# EAGLE design FilterSchematicsAttempt2 (EAGLE 8.2.2)
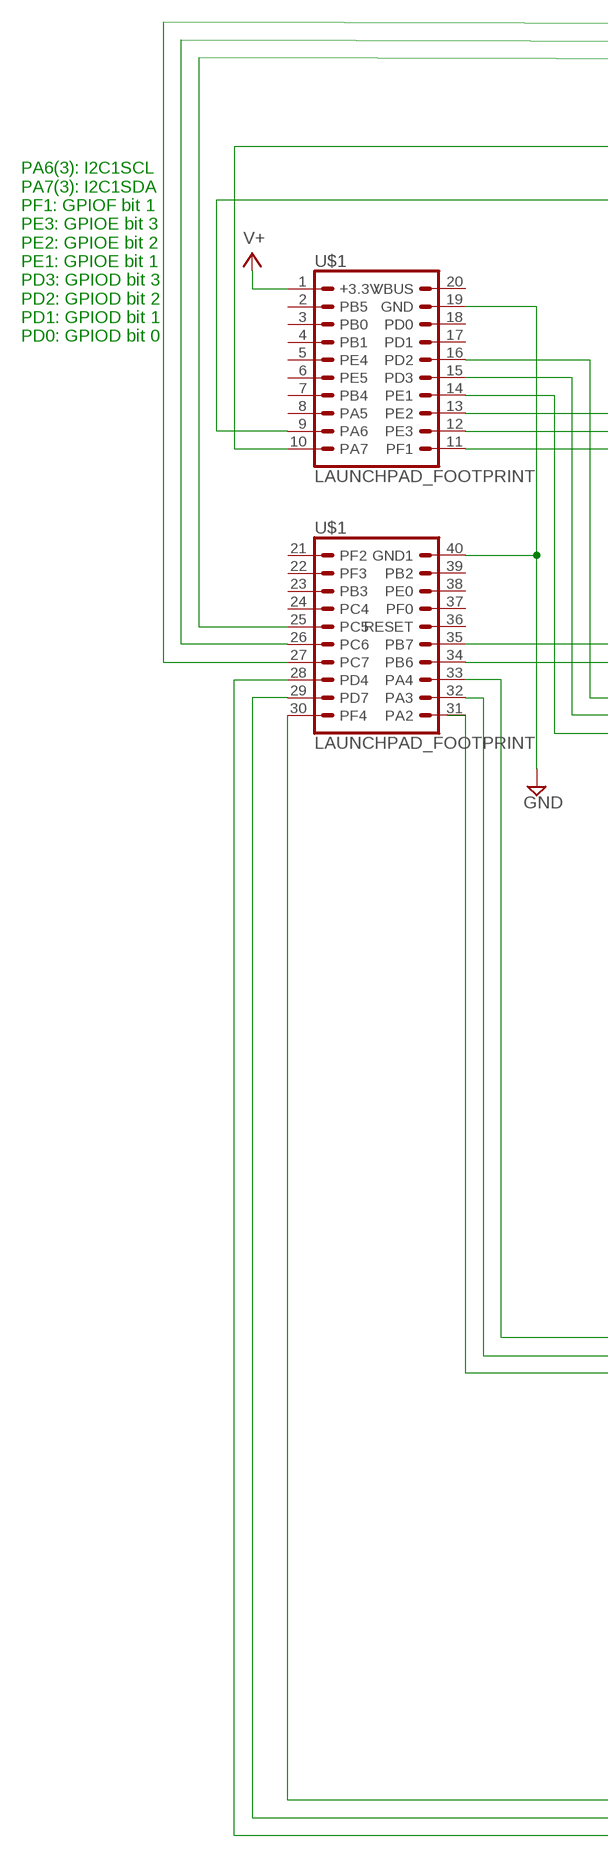
[diagram p0: schematic, sheet 1, part 1 of 3]
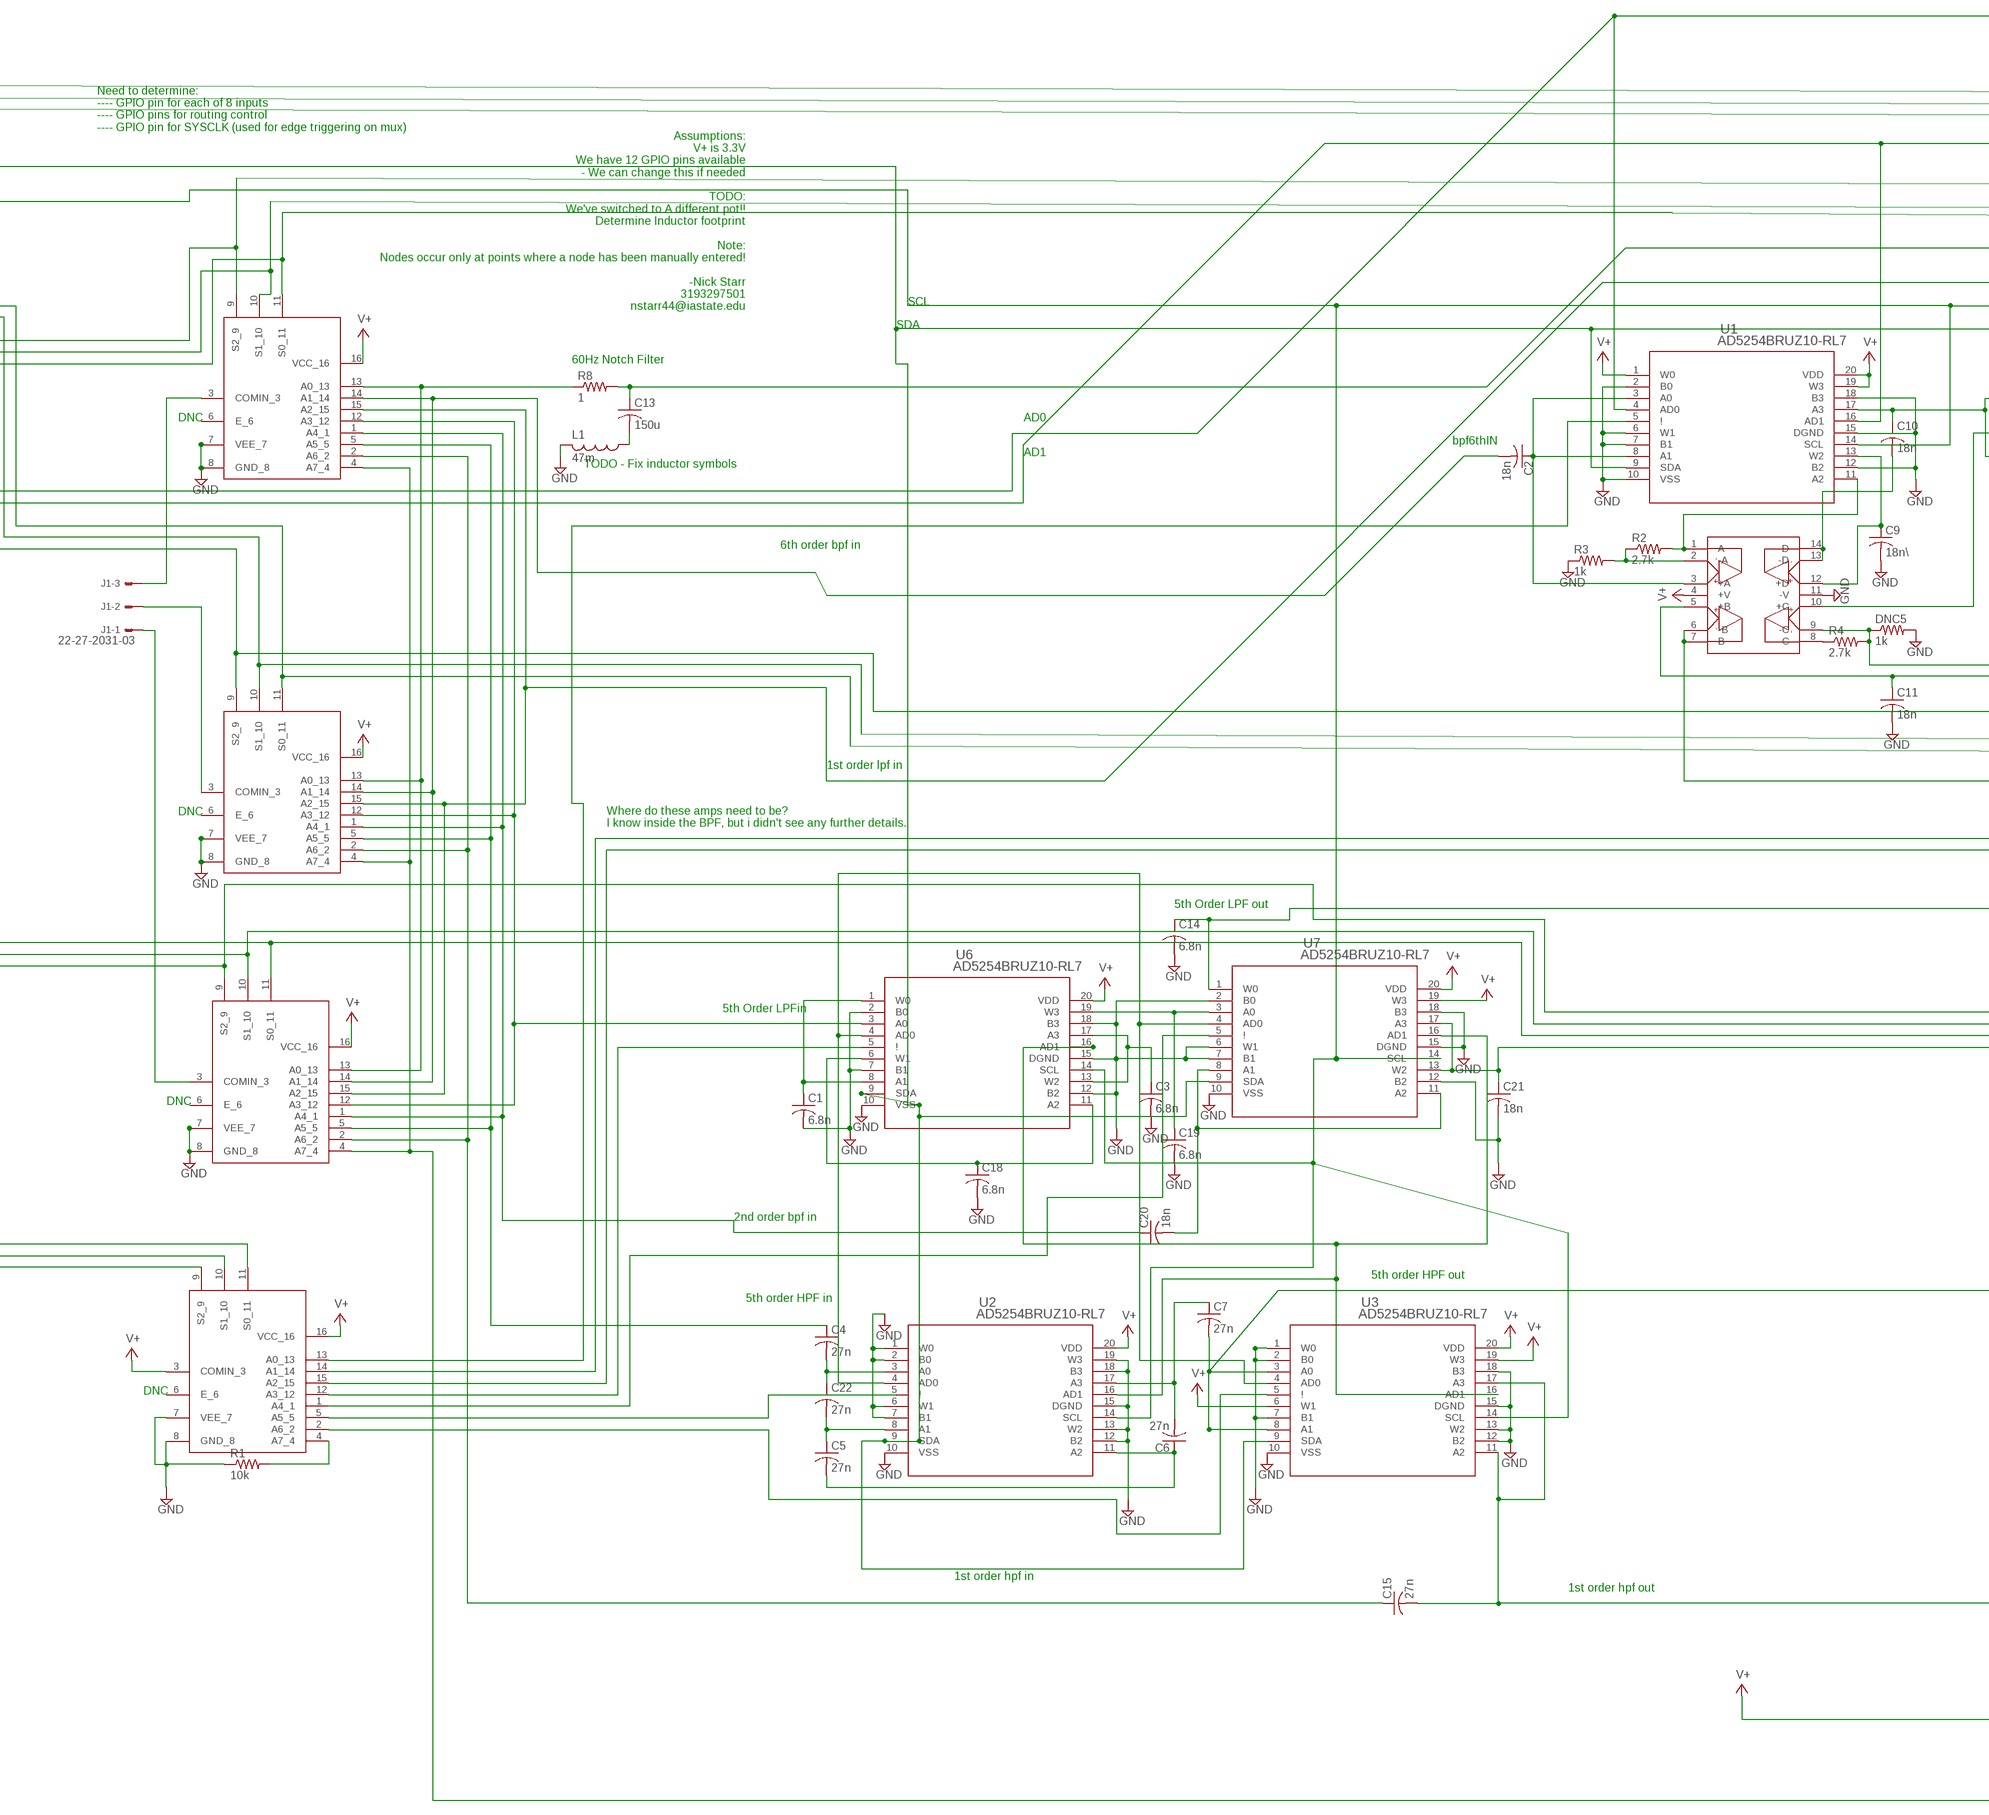
[diagram p1: schematic, sheet 1, part 2 of 3]
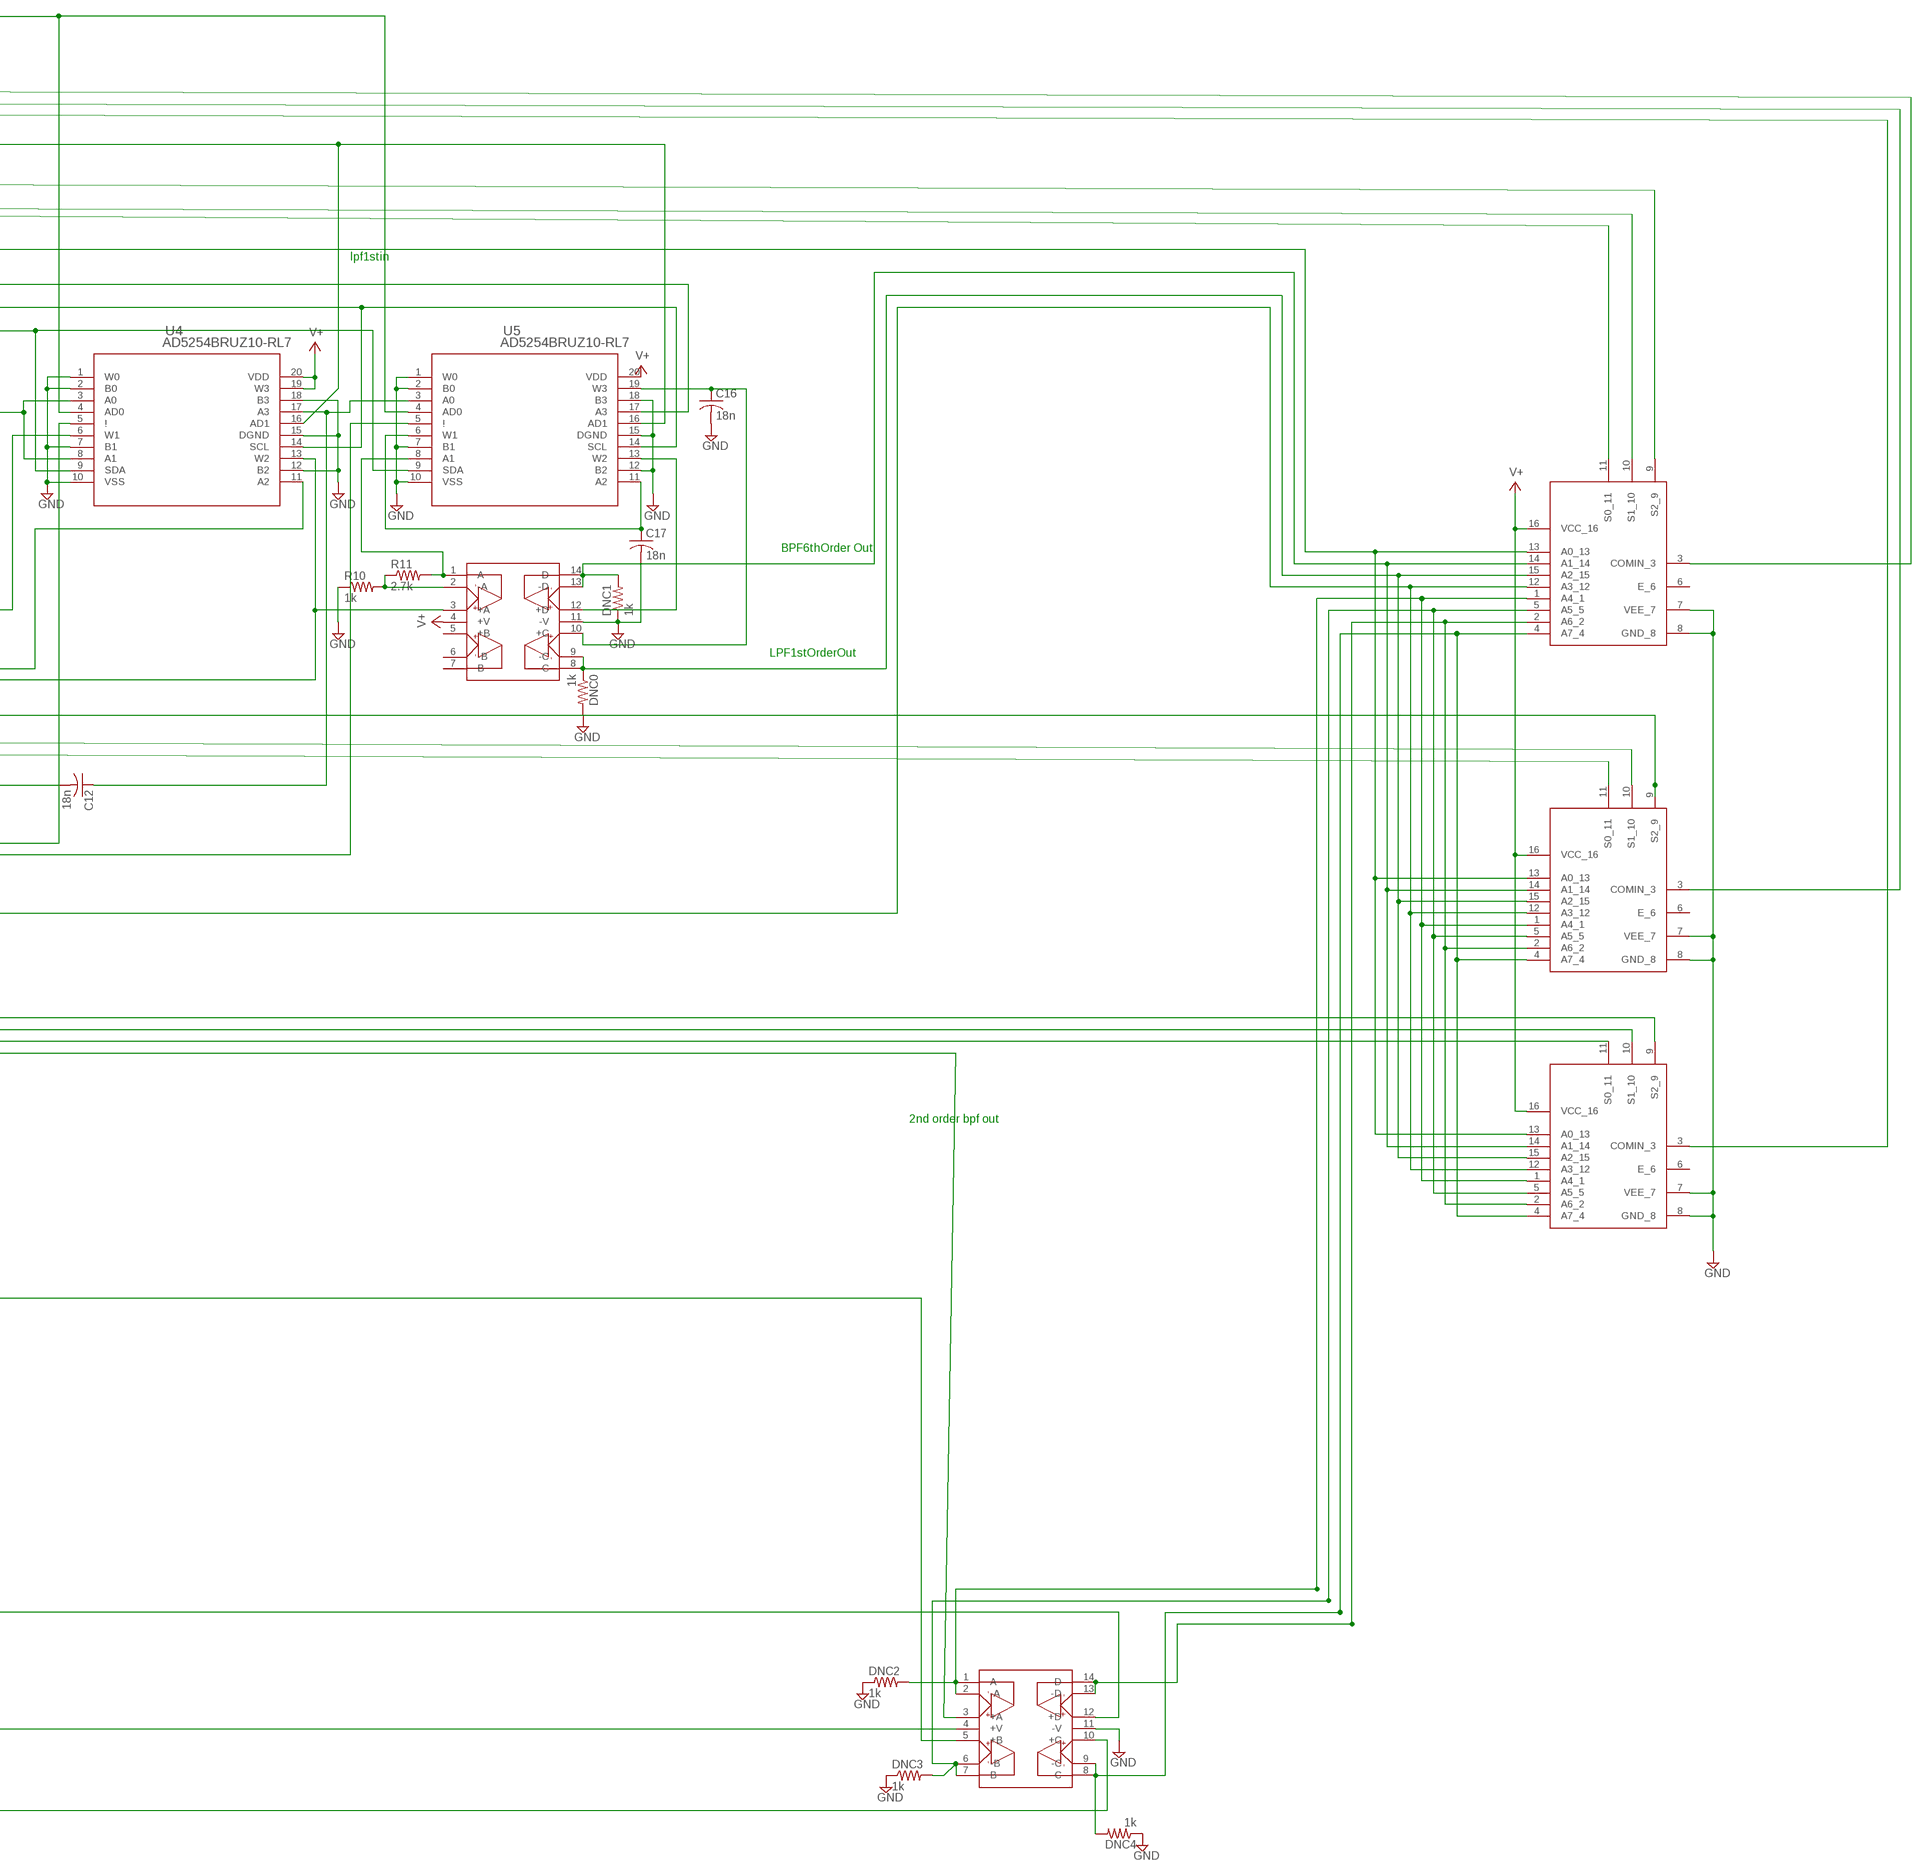
[diagram p2: schematic, sheet 1, part 3 of 3]

## Parts
C1  6.8n  C-USC0805  [C0805]
C2  18n  C-USC0805  [C0805]
C3  6.8n  C-USC0805  [C0805]
C4  27n  C-USC0805  [C0805]
C5  27n  C-USC0805  [C0805]
C6  27n  C-USC0805  [C0805]
C7  27n  C-USC0805  [C0805]
C9  18n\  C-USC0805  [C0805]
C10  18n  C-USC0805  [C0805]
C11  18n  C-USC0805  [C0805]
C12  18n  C-USC0805  [C0805]
C13  150u  C-USC0805  [C0805]
C14  6.8n  C-USC0805  [C0805]
C15  27n  C-USC0805  [C0805]
C16  18n  C-USC0805  [C0805]
C17  18n  C-USC0805  [C0805]
C18  6.8n  C-USC0805  [C0805]
C19  6.8n  C-USC0805  [C0805]
C20  18n  C-USC0805  [C0805]
C21  18n  C-USC0805  [C0805]
C22  27n  C-USC0805  [C0805]
DNC0  1k  R-US_R0805  [R0805]
DNC1  1k  R-US_R0805  [R0805]
DNC2  1k  R-US_R0805  [R0805]
DNC3  1k  R-US_R0805  [R0805]
DNC4  1k  R-US_R0805  [R0805]
DNC5  1k  R-US_R0805  [R0805]
J1  22-27-2031-03  [6410-03]
L1  47m  L-US0204/5  [0204/5]
R1  10k  R-US_R0805  [R0805]
R2  2.7k  R-US_R0805  [R0805]
R3  1k  R-US_R0805  [R0805]
R4  2.7k  R-US_R0805  [R0805]
R8  1  R-US_R0805  [R0805]
R10  1k  R-US_R0805  [R0805]
R11  2.7k  R-US_R0805  [R0805]
U1  AD5254BRUZ10-RL7  [RU_20]
U2  AD5254BRUZ10-RL7  [RU_20]
U3  AD5254BRUZ10-RL7  [RU_20]
U4  AD5254BRUZ10-RL7  [RU_20]
U5  AD5254BRUZ10-RL7  [RU_20]
U6  AD5254BRUZ10-RL7  [RU_20]
U7  AD5254BRUZ10-RL7  [RU_20]
U$1  LAUNCHPAD_FOOTPRINT  [SSW-110-02-S-D]
U$2  OPA4830  [TSSOP14]
U$3  CD74HC4051-Q1  [TSSOP16]
U$4  CD74HC4051-Q1  [TSSOP16]
U$5  CD74HC4051-Q1  [TSSOP16]
U$6  CD74HC4051-Q1  [TSSOP16]
U$7  OPA4830  [TSSOP14]
U$21  CD74HC4051-Q1  [TSSOP16]
U$22  CD74HC4051-Q1  [TSSOP16]
U$23  CD74HC4051-Q1  [TSSOP16]
U$25  OPA4830  [TSSOP14]

## Nets
GND: C1.2 C3.2 C9.2 C11.2 C14.2 C16.2 C17.2 C18.2 C19.2 C21.2 DNC0.2 DNC1.1 DNC2.1 DNC3.1 DNC4.1 DNC5.2 L1.2 R1.1 R3.1 R10.1 U1.2(B0) U1.6(W1) U1.7(B1) U1.10(VSS) U1.12(B2) U1.15(DGND) U1.18(B3) U2.1(W0) U2.2(B0) U2.6(W1) U2.7(B1) U2.10(VSS) U2.12(B2) U2.13(W2) U2.15(DGND) U2.18(B3) U2.19(W3) U3.1(W0) U3.2(B0) U3.7(B1) U3.10(VSS) U3.12(B2) U3.13(W2) U3.15(DGND) U3.18(B3) U4.1(W0) U4.2(B0) U4.7(B1) U4.10(VSS) U4.12(B2) U4.15(DGND) U4.18(B3) U5.1(W0) U5.2(B0) U5.7(B1) U5.10(VSS) U5.12(B2) U5.15(DGND) U5.18(B3) U6.2(B0) U6.7(B1) U6.10(VSS) U6.12(B2) U6.15(DGND) U6.18(B3) U7.2(B0) U7.6(W1) U7.7(B1) U7.10(VSS) U7.12(B2) U7.15(DGND) U7.18(B3) U$1.19(GND) U$1.40(GND1) U$2.11(-V) U$3.7(VEE_7) U$3.8(GND_8) U$4.7(VEE_7) U$4.8(GND_8) U$5.7(VEE_7) U$5.8(GND_8) U$6.7(VEE_7) U$6.8(GND_8) U$7.11(-V) U$21.7(VEE_7) U$21.8(GND_8) U$22.8(GND_8) U$23.7(VEE_7) U$23.8(GND_8)
N$1: J1.3 U$21.3(COMIN_3)
N$2: J1.2 U$22.3(COMIN_3)
N$3: J1.1 U$23.3(COMIN_3)
N$4: U$1.11(PF1) U$3.11(S0_11) U$21.11(S0_11)
N$5: C5.1 C22.2 U2.8(A1)
N$6: C4.2 C22.1 U2.3(A0)
N$7: C5.2 C6.1 U2.11(A2)
N$8: U$1.12(PE3) U$3.10(S1_10) U$21.10(S1_10)
N$9: U$1.13(PE2) U$3.9(S2_9) U$21.9(S2_9)
N$10: U$1.16(PD2) U$4.11(S0_11) U$22.11(S0_11)
N$11: U$1.15(PD3) U$4.10(S1_10) U$22.10(S1_10)
N$12: C2.1 U1.3(A0) U1.8(A1) U$2.3(+A)
N$13: C10.1 U1.17(A3) U4.3(A0) U4.8(A1)
N$14: C13.2 L1.1
N$15: U5.17(A3) U$21.15(A2_15) U$22.15(A2_15) U$23.15(A2_15)
N$16: C15.1 U$21.2(A6_2) U$22.2(A6_2) U$23.2(A6_2)
N$17: C15.2 U3.11(A2) U3.17(A3) U$25.12(+D)
N$18: U6.3(A0) U$21.12(A3_12) U$22.12(A3_12) U$23.12(A3_12)
N$19: U1.5(!) U$6.13(A0_13)
N$20: C1.1 U6.1(W0) U6.8(A1)
N$21: C3.1 U6.13(W2) U6.17(A3)
N$22: C18.1 U6.6(W1) U6.11(A2)
N$23: U$1.33(PA4) U$5.11(S0_11) U$23.11(S0_11)
N$24: R8.1 U$21.13(A0_13) U$22.13(A0_13) U$23.13(A0_13)
N$25: C2.2 U$21.14(A1_14) U$22.14(A1_14) U$23.14(A1_14)
N$26: U$1.32(PA3) U$5.10(S1_10) U$23.10(S1_10)
N$27: U$5.9(S2_9) U$23.9(S2_9)
N$28: R2.2 U1.11(A2) U$2.1(A)
N$29: C4.1 U$21.5(A5_5) U$22.5(A5_5) U$23.5(A5_5)
N$30: C21.1 U7.13(W2) U7.17(A3) U$25.3(+A)
N$31: U$21.4(A7_4) U$22.4(A7_4) U$23.4(A7_4) U$25.10(+C)
N$32: U1.9(SDA) U2.9(SDA) U3.9(SDA) U4.9(SDA) U5.9(SDA) U6.9(SDA) U7.9(SDA) U$1.10(PA7)
N$33: R1.2 U$6.4(A7_4)
N$34: U4.5(!) U$6.14(A1_14)
N$35: U5.5(!) U$6.15(A2_15)
N$36: U6.5(!) U$6.12(A3_12)
N$37: U7.5(!) U$6.1(A4_1)
N$38: U$6.5(A5_5)
N$41: C19.1 U6.19(W3) U7.3(A0)
N$42: DNC0.1 U$3.15(A2_15) U$4.15(A2_15) U$5.15(A2_15) U$7.8(C) U$7.9(-C)
N$44: U3.5(!) U$6.2(A6_2)
N$45: R2.1 R3.2 U$2.2(-A)
N$46: DNC3.2 U$3.5(A5_5) U$4.5(A5_5) U$5.5(A5_5) U$25.6(-B) U$25.7(B)
N$47: DNC2.2 U$3.1(A4_1) U$4.1(A4_1) U$5.1(A4_1) U$25.1(A) U$25.2(-A)
N$48: U$3.2(A6_2) U$4.2(A6_2) U$5.2(A6_2) U$25.13(-D) U$25.14(D)
N$49: DNC4.2 U$3.4(A7_4) U$4.4(A7_4) U$5.4(A7_4) U$25.8(C) U$25.9(-C)
N$50: C9.1 U1.13(W2) U$2.12(+D)
N$52: U1.16(AD1) U4.16(AD1) U5.16(AD1) U$1.34(PB6)
N$53: U4.6(W1) U$2.10(+C)
N$54: C10.2 U$2.13(-D) U$2.14(D)
N$55: U2.16(AD1) U3.16(AD1) U6.16(AD1) U7.16(AD1)
N$56: U$1.30(PF4) U$6.11(S0_11)
N$57: R4.1 U$2.8(C)
N$58: DNC5.1 R4.2 U4.11(A2) U$2.9(-C)
N$59: C20.1 U$21.1(A4_1) U$22.1(A4_1) U$23.1(A4_1)
N$60: C20.2 U7.8(A1) U7.11(A2)
N$61: U$22.7(VEE_7)
N$62: C6.2 C7.1 U2.17(A3)
N$63: C11.1 U4.13(W2) U$2.5(+B) U$7.3(+A)
N$64: U$1.25(PC5) U$5.3(COMIN_3)
N$65: U$1.26(PC6) U$4.3(COMIN_3)
N$66: U$1.28(PD4) U$6.9(S2_9)
N$67: C7.2 U3.3(A0) U3.8(A1) U$25.5(+B)
N$68: U$1.29(PD7) U$6.10(S1_10)
N$69: U$1.27(PC7) U$3.3(COMIN_3)
N$70: C12.1 U4.17(A3) U5.3(A0)
N$72: C12.2 U$2.6(-B) U$2.7(B)
N$73: R11.2 U5.8(A1) U$7.1(A)
N$74: R10.2 R11.1 U$7.2(-A)
N$75: C17.1 U5.6(W1) U5.11(A2)
N$76: U5.13(W2) U$7.12(+D)
N$77: DNC1.2 U$3.14(A1_14) U$4.14(A1_14) U$5.14(A1_14) U$7.13(-D) U$7.14(D)
N$79: C16.1 U5.19(W3) U$7.10(+C)
N$80: C14.1 U7.1(W0) U$3.12(A3_12) U$4.12(A3_12) U$5.12(A3_12)
N$88: C13.1 R8.2 U$3.13(A0_13) U$4.13(A0_13) U$5.13(A0_13)
N$95: U$1.14(PE1) U$4.9(S2_9) U$22.9(S2_9)
N$97: U2.4(AD0) U3.4(AD0) U6.4(AD0) U7.4(AD0)
N$98: U1.4(AD0) U4.4(AD0) U5.4(AD0) U$1.35(PB7)
N$101: U1.14(SCL) U2.14(SCL) U3.14(SCL) U4.14(SCL) U5.14(SCL) U6.14(SCL) U7.14(SCL) U$1.9(PA6)
V+: U1.1(W0) U1.19(W3) U1.20(VDD) U2.20(VDD) U3.6(W1) U3.19(W3) U3.20(VDD) U4.19(W3) U4.20(VDD) U5.20(VDD) U6.20(VDD) U7.19(W3) U7.20(VDD) U$1.1(+3.3V) U$2.4(+V) U$3.16(VCC_16) U$4.16(VCC_16) U$5.16(VCC_16) U$6.3(COMIN_3) U$6.16(VCC_16) U$7.4(+V) U$22.16(VCC_16) U$23.16(VCC_16) U$25.4(+V)
V-: U$25.11(-V) ; supply symbol labelled GND
Unconnected: U2.5(!) U$1.2(PB5) U$1.3(PB0) U$1.4(PB1) U$1.5(PE4) U$1.6(PE5) U$1.7(PB4) U$1.8(PA5) U$1.17(PD1) U$1.18(PD0) U$1.20(VBUS) U$1.21(PF2) U$1.22(PF3) U$1.23(PB3) U$1.24(PC4) U$1.31(PA2) U$1.36(RESET) U$1.37(PF0) U$1.38(PE0) U$1.39(PB2) U$3.6(E_6) U$4.6(E_6) U$5.6(E_6) U$6.6(E_6) U$7.5(+B) U$7.6(-B) U$7.7(B) U$21.6(E_6) U$21.16(VCC_16) U$22.6(E_6) U$23.6(E_6)

## Notes on the sheet
- Assumptions:
  V+ is 3.3V
  We have 12 GPIO pins available
  - We can change this if needed
  
  TODO:
  We've switched to A different pot!!
  Determine Inductor footprint
  
  Note:
  Nodes occur only at points where a node has been manually entered!
  
  -Nick Starr
  3193297501
  nstarr44@iastate.edu
- Need to determine:
  ---- GPIO pin for each of 8 inputs
  ---- GPIO pins for routing control
  ---- GPIO pin for SYSCLK (used for edge triggering on mux)
- lpf1stin
- PA6(3): I2C1SCL
  PA7(3): I2C1SDA
  PF1: GPIOF bit 1
  PE3: GPIOE bit 3
  PE2: GPIOE bit 2
  PE1: GPIOE bit 1
  PD3: GPIOD bit 3
  PD2: GPIOD bit 2
  PD1: GPIOD bit 1
  PD0: GPIOD bit 0
- SCL
- SDA
- 60Hz Notch Filter
- DNC | AD0
- bpf6thIN
- AD1
- TODO - Fix inductor symbols
- 6th order bpf in | BPF6thOrder Out
- LPF1stOrderOut
- 1st order lpf in
- DNC
- Where do these amps need to be?
  I know inside the BPF, but i didn't see any further details.
- 5th Order LPF out
- 5th Order LPFin
- DNC
- 2nd order bpf out
- 2nd order bpf in
- 5th order HPF out
- 5th order HPF in
- DNC
- 1st order hpf in
- 1st order hpf out

## Library data of the parts
C1-C7 C9-C22 = rcl:C-US: CAPACITOR, American symbol
DNC0 DNC1-DNC5 R1-R4 R8 R10 R11 = rcl:R-US_: RESISTOR, American symbol
J1 = con-molex:22-?-03: CONNECTOR wire to board 2.54 mm (.1 inch) pitch header; OC_FARNELL: unknown; OC_NEWARK: unknown
L1 = rcl:L-US: INDUCTOR, American symbol
U1-U7 = 491Library:AD5254BRUZ10-RL7; MANUFACTURER_PART_NUMBER: AD5254BRUZ10RL7; VENDOR: Analog Devices Inc
U$1 = 491Library:LAUNCHPAD_FOOTPRINT
U$2 U$7 U$25 = 491Library:OPA4830
U$3-U$6 U$21-U$23 = 491Library:CD74HC4051-Q1

## Board
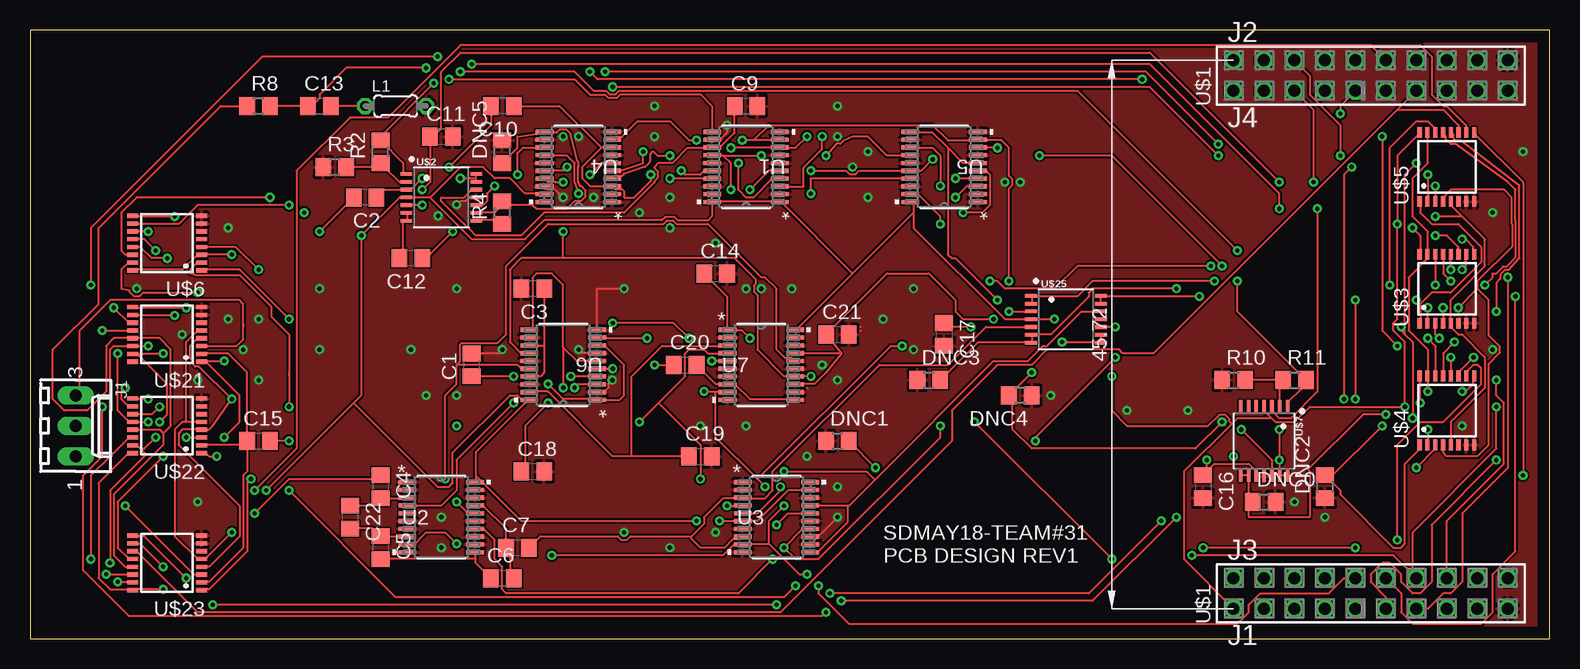
[diagram p3: board, top side]
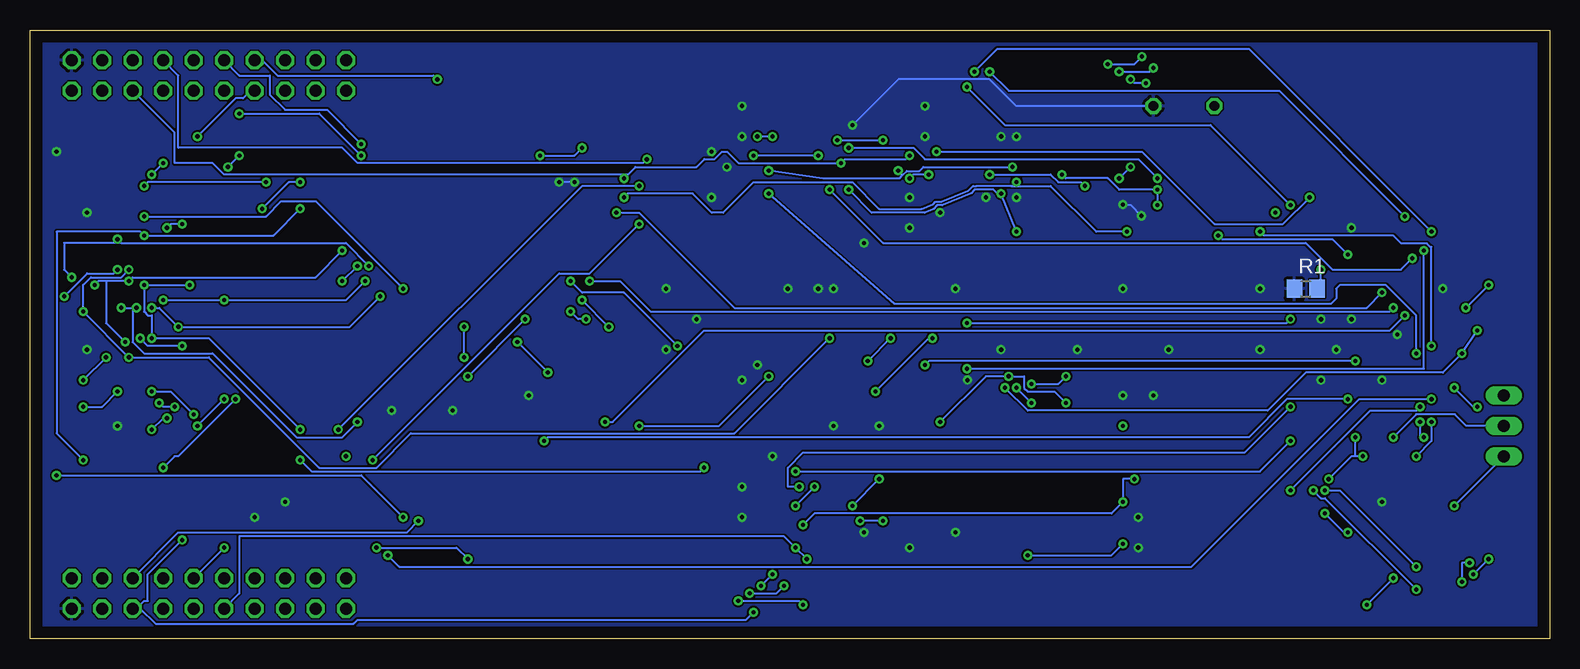
[diagram p4: board, bottom side, seen from below]

Size 126.67 x 50.79 mm. Coordinates in mm from the lower left corner, seen from the top.
Outline: 0,0 126.67,0 126.67,50.79 0,50.79 0,0
Copper layers (1*16): Top 0.035mm / dielectric 1.5mm / Bottom 0.035mm
Design rules "default": minimum track width 6mil, minimum drill 0.35mm, track to track 6mil, track to pad 6mil, pad to pad 6mil, via to via 6mil, smd to smd 6mil, copper to edge 40mil, drill to drill 6mil, minimum pad ring 10mil, minimum via ring 8mil, stop-mask expansion 4mil, vias tented up to drill 0mil, thermal gap 10mil

### Footprints (pad centres in the part's own frame; a part is rotated, then mirrored left to right if it is on the bottom)
C0805 = smd 1.3 x 1.5: 1 -0.95,0; 2 0.95,0
R0805 = smd 1.3 x 1.5: 1 -0.95,0; 2 0.95,0
6410-03 = drill 1.016 long: 1 2.54,0; 2 0,0; 3 -2.54,0
0204/5 = drill 0.813 octagon: 1 -2.54,0; 2 2.54,0
RU_20 = smd 1.473 x 0.356: 1 -2.819,2.925; 2 -2.819,2.275; 3 -2.819,1.625; 4 -2.819,0.975; 5 -2.819,0.325; 6 -2.819,-0.325; 7 -2.819,-0.975; 8 -2.819,-1.625; 9 -2.819,-2.275; 10 -2.819,-2.925; 11 2.819,-2.925; 12 2.819,-2.275; 13 2.819,-1.625; 14 2.819,-0.975; 15 2.819,-0.325; 16 2.819,0.325; 17 2.819,0.975; 18 2.819,1.625; 19 2.819,2.275; 20 2.819,2.925
SSW-110-02-S-D = drill 1 pad 1.5 octagon: 1 -22.86,11.43; 2 -20.32,11.43; 3 -22.86,8.89; 4 -20.32,8.89; 5 -22.86,6.35; 6 -20.32,6.35; 7 -22.86,3.81; 8 -20.32,3.81; 9 -22.86,1.27; 10 -20.32,1.27; 11 -22.86,-1.27; 12 -20.32,-1.27; 13 -22.86,-3.81; 14 -20.32,-3.81; 15 -22.86,-6.35; 16 -20.32,-6.35; 17 -22.86,-8.89; 18 -20.32,-8.89; 19 -22.86,-11.43; 20 -20.32,-11.43; 21 20.32,11.43; 22 22.86,11.43; 23 20.32,8.89; 24 22.86,8.89; 25 20.32,6.35; 26 22.86,6.35; 27 20.32,3.81; 28 22.86,3.81; 29 20.32,1.27; 30 22.86,1.27; 31 20.32,-1.27; 32 22.86,-1.27; 33 20.32,-3.81; 34 22.86,-3.81; 35 20.32,-6.35; 36 22.86,-6.35; 37 20.32,-8.89; 38 22.86,-8.89; 39 20.32,-11.43; 40 22.86,-11.43
TSSOP14 = smd 0.305 x 0.991: 1 -1.95,-2.918; 2 -1.3,-2.918; 3 -0.65,-2.918; 4 0,-2.918; 5 0.65,-2.918; 6 1.3,-2.918; 7 1.95,-2.918; 8 1.95,2.918; 9 1.3,2.918; 10 0.65,2.918; 11 0,2.918; 12 -0.65,2.918; 13 -1.3,2.918; 14 -1.95,2.918
TSSOP16 = smd 0.9 x 0.35: 1 -2.875,2.275; 2 -2.875,1.625; 3 -2.875,0.975; 4 -2.875,0.325; 5 -2.875,-0.325; 6 -2.875,-0.975; 7 -2.875,-1.625; 8 -2.875,-2.275; 9 2.875,-2.275; 10 2.875,-1.625; 11 2.875,-0.975; 12 2.875,-0.325; 13 2.875,0.325; 14 2.875,0.975; 15 2.875,1.625; 16 2.875,2.275

### Placement (x,y rotation side)
C1  36.83,22.86 90 top
C2  27.94,36.83 180 top
C3  41.91,29.21 180 top
C4  29.21,12.7 270 top
C5  29.21,7.62 270 top
C6  39.37,5.08 0 top
C7  40.64,7.62 0 top
C9  59.69,44.45 0 top
C10  39.37,44.45 180 top
C11  34.29,41.91 0 top
C12  31.75,31.75 180 top
C13  24.13,44.45 0 top
C14  57.15,30.48 0 top
C15  19.05,16.51 0 top
C16  97.79,12.7 270 top
C17  76.2,25.4 270 top
C18  41.91,13.97 0 top
C19  55.88,15.24 0 top
C20  54.61,22.86 0 top
C21  67.31,25.4 0 top
C22  26.67,10.16 270 top
DNC0  102.87,11.43 0 top
DNC1  67.31,16.51 0 top
DNC2  107.95,12.7 90 top
DNC3  74.93,21.59 0 top
DNC4  82.55,20.32 180 top
DNC5  39.37,40.64 90 top
J1  3.81,17.78 270 top
L1  30.48,44.45 0 top
R1  20.32,29.21 0 bottom
R2  29.21,40.64 90 top
R3  25.4,39.37 0 top
R4  39.37,35.56 90 top
R8  19.05,44.45 0 top
R10  100.33,21.59 0 top
R11  105.41,21.59 0 top
U1  59.69,39.37 180 top
U2  34.29,10.16 0 top
U3  62.23,10.16 0 top
U4  45.72,39.37 180 top
U5  76.2,39.37 180 top
U6  44.45,22.86 180 top
U7  60.96,22.86 0 top
U$1  111.76,25.4 90 top
U$2  34.29,36.83 270 top
U$3  118.11,29.21 90 top
U$4  118.11,19.05 90 top
U$5  118.11,39.37 90 top
U$6  11.43,33.02 180 top
U$7  102.87,16.51 180 top
U$21  11.43,25.4 180 top
U$22  11.43,17.78 180 top
U$23  11.43,6.35 180 top
U$25  86.36,26.67 270 top

### Tracks (layer width: path | path; a pad name or v marks a point on that pad's centre or on a via)
GND  (via drill 0.35)
  Top 0.152: v58.1,42.86 58.1,42.23 57.47,41.59 57.15,41.59 U1.12 | C17.2 76.28,24.37 | 69.22,25.72 69.24,25.72 | 69.22,26.04 69.24,26.04 | 64.77,20.95 64.82,20.89 | U7.10 58.1,20 58.13,19.92 | v39.37,24.13 39.05,23.81 C1.2 | U6.10 47.27,29.21 v49.53,29.21 | v48.54,21.59 48.23,21.29 48.23,20.96 47.86,20.59 U6.2 | U6.7 46.02,23.84 v45.72,24.13 | U3.12 65.05,7.9 v67.31,10.16 | U$2.11 36.63,36.83 36.32,36.52 35.86,36.52 v35.56,36.22 | U4.18 43.14,37.5 43.73,37.5 44.4,36.83 v44.45,36.83
  Bottom 0.152: v58.1,42.86 54.29,46.67 46.67,46.67 44.45,44.45 L1.2 | v35.56,36.22 34.95,36.22 v34.02,35.29 | v81.28,38.1 v82.55,38.1
  other vias: 12.7,25.4 17.78,24.13 19.05,21.59 13.97,21.59 24.13,29.21 24.13,24.13 33.02,20.32 35.56,20.32 31.75,24.13 35.56,29.21 55.88,17.78 59.69,17.78 64.77,15.24 67.31,12.7 73.66,24.13 85.09,20.32 91.44,19.05 96.52,19.05 105.41,11.43 107.95,10.16 66.04,22.86 67.31,21.59 71.12,26.67 73.66,29.21 67.31,44.45 67.31,41.91 69.85,40.64 13.97,11.43 46.99,36.83 53.34,34.29 57.15,33.02 50.8,35.56 60.96,29.21 63.5,29.21 57.15,8.89 49.53,8.89 53.34,7.62 68.58,39.37 69.85,36.83 16.51,26.67 19.05,26.67 8.89,29.21 16.51,34.29 124.46,40.64 121.92,35.56 121.92,24.13 34.29,10.16 34.29,7.62 59.69,29.21 44.45,41.91 45.72,41.91 53.34,36.83 52.07,44.45 52.07,41.91 119.38,17.78
  pour Bottom: 0,50.8 0,0 127,0 127,50.8
  pour Top: 0,50.8 127,50.8 127,0 0,0
N$1
  Top 0.152: 17.78,26.29 17.78,26.04 | 17.78,26.29 17.78,27.94 17.46,28.26 6.67,28.26 4.13,25.72 4.13,20.64 J1.3 | U$21.3 14.61,24.45 17.24,24.45 17.35,24.56 | 17.53,24.74 17.35,24.56 | 17.35,24.56 17.53,24.74 | 17.53,24.74 17.78,24.99 17.78,26.29
N$2  (via drill 0.35)
  Top 0.152: v13.02,16.83 14.29,16.83 U$22.3
  Bottom 0.152: v13.02,16.83 11.11,18.73 7.89,18.73 6.93,17.78 J1.2 4.13,17.78
N$3  (via drill 0.35)
  Top 0.152: v7.94,11.11 13.65,5.4 14.29,5.4 U$23.3
  Bottom 0.152: J1.1 v7.94,11.11
N$4  (via drill 0.35)
  Top 0.152: v6.99,27.62 8.26,26.35 U$21.11 | v5.08,29.53 5.08,34.29 19.37,48.58 v33.97,48.58 | v36.83,47.94 93.34,47.94 104.14,37.15 v104.14,35.88 | v117.16,33.66 118.11,33.66 119.06,32.7 119.06,32.38 U$3.11 | U$1.11 113.03,3.49 111.76,4.76 111.76,5.4 112.71,6.35 113.35,6.35 114.3,5.4 114.3,4.76 115.25,3.81 115.89,3.81 116.84,4.76 116.84,9.53 v122.24,14.92
  Bottom 0.152: v5.08,29.53 v6.99,27.62 | v33.97,48.58 34.61,47.94 v36.83,47.94 | v104.14,35.88 106.36,33.66 v117.16,33.66 117.47,33.97 124.46,33.97 124.46,17.14 v122.24,14.92
N$5
  Top 0.152: C5.1 31.43,8.57 U2.8 | C5.1 28.57,9.21 C22.2 | C5.1
N$6
  Top 0.152: C4.2 31.43,11.75 U2.3 | C4.2 28.57,11.11 C22.1 | C4.2
N$7
  Top 0.152: 37.15,6.67 37.15,6.35 C6.1 | 37.15,6.67 37.15,7.3 U2.11 | 37.15,6.67 C5.2
N$8  (via drill 0.35)
  Top 0.152: v12.06,26.99 8.57,26.99 U$21.10 | v90.17,6.67 v78.74,18.1 | v110.49,7.62 v97.79,7.62 | v119.38,30.8 119.7,31.11 119.7,32.07 U$3.10 | v123.83,28.57 123.83,7.3 121.92,5.4 121.92,2.22 120.97,1.27 115.25,1.27 114.3,2.22 114.3,3.81 U$1.12
  Bottom 0.152: v12.06,26.99 13.34,25.72 70.48,25.72 78.11,18.1 v78.74,18.1 | v90.17,6.67 91.12,7.62 v97.79,7.62 | U$1.12 v110.49,7.62 | v119.38,30.8 119.7,30.48 121.92,30.48 v123.83,28.57
N$9  (via drill 0.35)
  Top 0.152: v13.02,27.62 8.57,27.62 U$21.9 | v80.01,29.84 80.64,29.84 81.28,29.21 85.41,29.21 87.31,31.11 v98.42,31.11 | v119.38,33.34 119.7,33.34 120.33,32.7 120.33,32.38 U$3.9 | U$1.13 116.52,2.54 117.79,3.81 118.43,3.81 119.38,4.76 119.38,10.48 123.19,14.29 v123.19,30.16
  Bottom 0.152: v13.02,27.62 13.34,27.3 74.93,27.3 77.47,29.84 v80.01,29.84 | v98.42,31.11 100.33,33.02 119.06,33.02 | v119.38,33.34 119.06,33.02 | v123.19,30.16 123.83,30.8 123.83,33.02 119.06,33.02
N$10  (via drill 0.35)
  Top 0.152: v10.79,19.37 10.16,18.73 8.57,18.73 U$22.11 | v21.59,12.38 30.48,3.49 62.87,3.49 v63.82,4.45 | v66.67,3.81 88.27,3.81 v94.3,9.84 | v120.33,23.5 119.06,22.23 U$4.11 | v122.24,21.59 122.24,20.32 122.87,19.68 122.87,14.61 118.11,9.84 U$1.16
  Bottom 0.152: v10.79,19.37 11.11,19.05 14.92,19.05 v21.59,12.38 | v63.82,4.45 64.45,3.81 v66.67,3.81 | v94.3,9.84 95.25,8.89 114.3,8.89 U$1.16 | v122.24,21.59 v120.33,23.5
N$11  (via drill 0.35)
  Top 0.152: v7.94,20.95 7.62,20.64 7.62,20 8.26,19.37 U$22.10 | v6.03,19.37 6.03,15.24 4.45,13.65 4.45,5.71 8.26,1.91 66.04,1.91 v66.36,2.22 | v113.98,8.26 113.98,16.19 115.89,18.1 117.79,18.1 120.97,21.27 120.97,22.54 120.65,22.86 120.33,22.86 119.7,22.23 U$4.10
  Bottom 0.152: v7.94,20.95 6.35,19.37 v6.03,19.37 | v66.36,2.22 66.99,1.59 99.38,1.59 99.69,1.27 116.2,1.27 117.47,2.54 117.79,2.54 | v113.98,8.26 116.84,5.4 116.84,3.17 117.16,3.17 117.79,2.54 | 117.79,2.54 U$1.15
N$12  (via drill 0.35)
  Top 0.152: C2.1 29.53,37.47 31.11,37.47 U$2.3 31.43,37.47 31.75,37.47 v32.7,38.42 | 63.18,37.78 62.55,37.78 U1.3 64.48,37.74 64.48,39.3 66.04,40.86 v66.04,41.91 | v58.42,40.96 62.23,40.96 U1.8 62.55,40.96 63.82,40.96 v64.77,41.91
  Bottom 0.152: v32.7,38.42 34.29,40.01 52.07,40.01 53.02,40.96 v58.42,40.96 | v64.77,41.91 v66.04,41.91
N$13  (via drill 0.35)
  Top 0.152: 47.62,40.96 46.04,39.37 46.04,38.42 46.67,37.78 48.26,37.78 U4.3 | 47.62,40.96 48.26,40.96 U4.8 | v53.34,38.42 56.83,38.42 U1.17 | 48.58,37.78 U4.3 | C10.1 44.13,44.45 47.62,40.96 | U4.3 48.8,37.5 49.37,37.5 49.51,37.37 49.51,36.85 49.53,36.83 50.37,36.83 51.75,38.21 v51.75,38.73
  Bottom 0.152: v53.34,38.42 53.02,38.73 v51.75,38.73
N$14
  Top 0.152: L1.1 C13.2
N$15  (via drill 0.35)
  Top 0.152: v7.3,4.76 8.26,4.76 U$23.15 | v6.67,6.35 6.67,12.38 9.53,15.24 9.53,15.56 9.21,15.88 | 9.21,15.88 8.89,16.19 8.57,16.19 U$22.15 | 8.89,23.81 8.57,23.81 U$21.15 8.89,23.81 | 8.89,23.81 11.43,21.27 11.43,18.73 v10.79,18.1 | v10.48,16.83 9.53,15.88 9.21,15.88 | v65.09,37.15 65.09,38.42 73.34,38.42 U5.17 | 8.89,23.81 v11.11,23.81
  Bottom 0.152: v7.3,4.76 7.3,6.35 v6.67,6.35 | v10.79,18.1 10.79,16.83 v10.48,16.83 | v65.09,37.15 54.61,27.94 18.23,27.94 17.78,28.39 17.78,29.21 17.46,29.53 14.29,29.53 13.97,29.53 13.65,29.53 11.11,26.99 v11.11,23.81
N$16
  Top 0.152: C15.1 18.1,16.19 | 18.1,16.19 18.1,13.97 17.78,13.65 17.78,7.62 14.92,4.76 14.61,4.76 U$23.2 | 18.1,16.19 14.61,16.19 U$22.2 | 18.1,16.19 C15.1 | C15.1 18.1,22.23 16.51,23.81 14.61,23.81 U$21.2
N$17  (via drill 0.35)
  Top 0.152: 70.42,13.27 68.26,11.11 68.18,11.11 | 70.42,13.27 80.33,23.18 83.19,23.18 84.45,24.45 84.77,24.45 87.63,27.3 89.22,27.3 U$25.12 | 68.18,11.11 65.09,11.11 U3.17 | U3.11 65.09,7.3 65.72,7.3 68.18,9.76 68.18,11.11 | v21.59,16.51 C15.2 | 70.42,13.27 69.73,13.97 v62.87,13.97
  Bottom 0.152: v21.59,16.51 24.13,13.97 v62.87,13.97
N$18  (via drill 0.35)
  Top 0.152: v11.11,15.24 7.3,11.43 7.3,7.62 8.26,6.67 U$23.12 | v9.84,18.1 8.57,18.1 U$22.12 8.26,18.1 7.3,19.05 v7.3,23.81 | v6.03,25.72 8.26,25.72 U$21.12 | v45.4,20.95 45.72,21.27 46.99,21.27 U6.3
  Bottom 0.152: v11.11,15.24 9.84,16.51 v9.84,18.1 | v6.03,25.72 v7.3,23.81 8.89,22.23 20.32,22.23 23.5,19.05 43.5,19.05 v45.4,20.95
N$19  (via drill 0.35)
  Top 0.152: v11.43,31.75 10.16,31.75 9.21,32.7 8.57,32.7 U$6.13 | v60.01,37.47 61.59,39.05 62.23,39.05 U1.5
  Bottom 0.152: v11.43,31.75 12.38,30.8 18.1,30.8 20.32,33.02 55.56,33.02 v60.01,37.47
N$20  (via drill 0.35)
  Top 0.152: 47.31,20 U6.1 | U6.8 47.31,24.45 47.94,24.45 49.53,22.86 49.53,20.32 49.15,19.93 U6.1 | v40.32,21.91 38.1,21.91 C1.1 | v43.18,21.27 44.45,20 46.99,20 U6.1
  Bottom 0.152: v40.32,21.91 40.96,21.27 v43.18,21.27
N$21
  Top 0.152: 42.86,24.45 C3.1 | 42.86,24.45 42.86,22.23 42.55,21.91 41.91,21.91 U6.17 | 42.86,24.45 41.91,24.45 U6.13
N$22  (via drill 0.35)
  Top 0.152: 46.67,23.18 46.99,23.18 U6.6 45.6,23.18 44.45,24.33 | U6.11 41.91,25.72 41.91,30.16 42.23,30.48 43.5,30.48 44.45,29.53 44.45,24.33 | v43.18,19.68 41.27,17.78 41.27,13.97 C18.1 | 44.45,24.33 v44.45,20.95
  Bottom 0.152: v44.45,20.95 v43.18,19.68
N$23
  Top 0.152: U$1.33 113.98,44.13 | 113.98,44.13 93.66,23.81 91.12,23.81 90.81,24.13 84.77,24.13 83.5,22.86 80.64,22.86 76.83,19.05 76.83,16.51 62.55,2.22 13.97,2.22 8.89,7.3 8.57,7.3 U$23.11 | 113.98,44.13 117.79,44.13 119.06,42.86 119.06,42.55 U$5.11
N$24
  Top 0.152: 11.11,17.14 11.11,16.19 6.99,12.06 6.99,6.99 7.94,6.03 8.26,6.03 U$23.13 | 11.11,17.14 10.79,17.46 8.57,17.46 U$22.13 | 11.11,17.14 11.75,17.78 11.75,24.13 10.79,25.08 8.57,25.08 U$21.13 8.26,25.08 6.99,25.08 6.35,24.45 6.35,20.64 4.76,19.05 2.86,19.05 1.91,20 1.91,24.13 5.71,27.94 5.71,34.29 15.88,44.45 R8.1
N$25  (via drill 0.35)
  Top 0.152: v6.35,5.4 8.26,5.4 U$23.14 | v5.08,6.67 5.08,13.65 6.67,15.24 | 6.67,15.24 8.26,16.83 U$22.14 | 6.67,15.24 6.67,24.13 6.99,24.45 8.26,24.45 U$21.14 8.57,24.45 v9.84,24.45 | v24.13,33.97 C2.2
  Bottom 0.152: v5.08,6.67 v6.35,5.4 | v24.13,33.97 23.81,33.66 13.03,33.66 12.37,32.99 10.23,32.99 9.94,32.7 9.84,32.7 v9.84,24.45
N$26  (via drill 0.35)
  Top 0.152: v11.11,6.03 9.21,7.94 8.57,7.94 U$23.10 | v18.73,12.38 22.23,15.88 22.23,39.05 26.67,43.5 29.84,43.5 35.88,49.53 111.76,49.53 | U$1.32 111.76,49.53 | 111.76,49.53 115.89,49.53 116.84,48.58 116.84,45.4 117.79,44.45 118.11,44.45 119.7,42.86 119.7,42.55 U$5.10
  Bottom 0.152: v11.11,6.03 17.46,12.38 v18.73,12.38
N$27  (via drill 0.35)
  Top 0.152: v13.02,5.08 9.53,8.57 8.57,8.57 U$23.9 | v62.23,2.86 v15.24,2.86 | v67.63,3.17 88.58,3.17 v95.57,10.16 | v124.46,13.65 124.46,38.1 120.33,42.23 U$5.9
  Bottom 0.152: v15.24,2.86 v13.02,5.08 | v62.23,2.86 62.55,3.17 v67.63,3.17 | v95.57,10.16 99.06,13.65 v124.46,13.65
N$28  (via drill 0.35)
  Top 0.152: R2.2 31.11,39.69 31.11,38.73 U$2.1 | v34.92,46.67 45.4,46.67 46.67,45.4 47.92,45.4 48.2,45.13 48.95,45.13 49.24,45.41 55.88,45.41 56.87,44.42 U1.11 | v33.66,46.35 29.21,41.91 R2.2 | R2.2
  Bottom 0.152: v34.92,46.67 34.61,46.35 v33.66,46.35
N$29  (via drill 0.35)
  Top 0.152: 13.02,18.1 14.29,18.1 U$22.5 | 13.02,18.1 12.7,18.1 12.06,17.46 12.06,8.57 13.97,6.67 14.29,6.67 U$23.5 14.61,6.67 v16.83,8.89 | 13.02,18.1 13.02,24.77 13.97,25.72 14.29,25.72 U$21.5 | v18.73,10.48 21.59,13.34 29.21,13.34 C4.1
  Bottom 0.152: v18.73,10.48 17.14,8.89 v16.83,8.89
N$30  (via drill 0.35)
  Top 0.152: v81.6,27.3 83.19,27.3 U$25.3 | v80.33,26.67 77.79,26.67 77.15,27.3 77.15,28.26 74.93,30.48 71.44,30.48 68.26,27.3 68.1,27.15 C21.1 | C21.1 67.63,23.81 | 67.63,23.81 66.36,22.23 65.41,21.27 63.82,21.27 U7.13 | C21.1 | 67.63,23.81 63.82,23.81 U7.17
  Bottom 0.152: v81.6,27.3 80.96,26.67 v80.33,26.67
N$31  (via drill 0.35)
  Top 0.152: U$23.4 14.61,6.03 14.92,6.03 17.46,8.57 17.46,11.11 12.38,16.19 12.38,17.14 12.7,17.46 14.29,17.46 U$22.4 14.61,17.46 14.92,17.46 15.24,17.78 v16.83,20 14.05,22.72 13.76,22.72 13.63,22.86 13.63,23.13 13.34,23.42 13.34,24.45 13.97,25.08 14.29,25.08 U$21.4 | v90.49,26.04 89.53,26.04 U$25.10 | v90.49,23.5 83.82,16.83 v83.82,16.51
  Bottom 0.152: v90.49,23.5 v90.49,26.04 | v83.82,16.51 83.5,16.83 25.08,16.83 21.91,20 v16.83,20
N$32  (via drill 0.35)
  Top 0.152: 60.33,41.59 62.23,41.59 U1.9 | 60.33,41.59 v59.37,41.59 | 60.33,41.59 61.59,42.86 75.25,42.86 76.52,41.59 78.74,41.59 U5.9 79.06,41.59 80.96,41.59 81.6,40.96 81.6,38.64 81.89,38.35 81.89,37.85 81.6,37.56 v81.6,29.84 | v56.2,20.64 57.15,20.64 | 57.15,20.64 58.1,20.64 U7.9 | v51.44,25.08 47.31,25.08 U6.9 | v43.5,6.99 57.78,6.99 58.74,7.94 59.37,7.94 U3.9 59.69,7.94 61.59,7.94 | 31.75,7.94 U2.9 32.06,7.88 32.44,8.26 32.44,8.31 33.02,8.89 34.61,8.89 v35.56,7.94 | U$1.10 109.54,5.08 108.27,3.81 102.55,3.81 101.6,2.86 101.6,2.22 100.65,1.27 68.26,1.27 65.72,3.81 v65.72,4.45 | v64.77,5.4 64.14,5.4 61.59,7.94 | 57.15,20.64 57.15,16.83 60.64,13.34 | v61.28,12.7 60.64,13.34 | v62.87,11.11 61.59,9.84 61.59,7.94 | v72.71,24.45 71.75,24.45 60.64,13.34 | U4.9 48.78,41.89 49.37,41.89 50.66,43.18 53.34,43.18 54.93,41.59 v55.56,41.59
  Bottom 0.152: v59.37,41.59 v55.56,41.59 | v56.2,20.64 51.75,25.08 v51.44,25.08 | v35.56,7.94 36.51,6.99 v43.5,6.99 | v64.77,5.4 v65.72,4.45 | v62.87,11.11 v61.28,12.7 | v81.6,29.84 80.64,28.89 77.15,28.89 v72.71,24.45
N$33  (via drill 0.35)
  Top 0.152: v19.05,30.8 17.14,32.7 14.61,32.7 U$6.4
  Bottom 0.152: v19.05,30.8 19.05,29.21 R1.2
N$34  (via drill 0.35)
  Top 0.152: v20,36.83 8.89,36.83 7.62,35.56 7.62,32.38 7.94,32.07 8.26,32.07 U$6.14 | v51.12,40.64 51.12,39.69 49.21,39.05 48.58,39.05 U4.5
  Bottom 0.152: v20,36.83 22.23,34.61 27.94,34.61 33.97,40.64 v51.12,40.64
N$35  (via drill 0.35)
  Top 0.152: v13.97,28.89 9.54,28.89 9.45,28.91 9.14,28.6 8.64,28.6 8.28,28.96 8.28,29.1 7.62,29.21 7.62,30.8 8.26,31.43 U$6.15 | v77.79,35.56 79.38,35.56 80.01,36.2 80.01,38.73 79.69,39.05 79.06,39.05 U5.5
  Bottom 0.152: v13.97,28.89 15.24,27.62 67.94,27.62 75.88,35.56 v77.79,35.56
N$36  (via drill 0.35)
  Top 0.152: v10.48,32.38 9.53,33.34 8.57,33.34 U$6.12 | v48.58,22.54 47.31,22.54 U6.5
  Bottom 0.152: v10.48,32.38 10.48,22.54 v48.58,22.54
N$37  (via drill 0.35)
  Top 0.152: v21.59,26.67 17.46,30.8 14.61,30.8 U$6.1 | v48.58,26.35 53.66,26.35 v54.93,25.08 | v56.83,23.18 58.1,23.18 U7.5
  Bottom 0.152: v21.59,26.67 21.91,26.35 v48.58,26.35 | v56.83,23.18 v54.93,25.08
N$39  (via drill 0.35)
  other vias: 22.86,35.56
N$40  (via drill 0.35)
  other vias: 35.56,17.78
N$41
  Top 0.152: C19.1 50.16,15.24 | 50.16,15.24 48.58,15.24 43.18,20.64 41.91,20.64 U6.19 | 50.16,15.24 50.16,21.91 52.7,24.45 58.1,24.45 U7.3
N$42  (via drill 0.35)
  Top 0.152: U$7.8 100.97,13.65 101.6,13.65 U$7.9 101.6,13.34 101.6,11.75 | 101.6,11.75 DNC0.1 | U$5.15 116.52,42.23 116.52,39.69 115.25,38.42 115.25,35.24 116.52,33.97 116.52,32.38 U$3.15 116.52,32.07 116.52,31.75 114.94,30.16 114.94,25.72 116.52,24.13 116.52,22.23 U$4.15 116.52,21.91 v116.52,20.64 | v113.03,18.73 111.12,18.73 106.52,14.13 106.68,13.97 106.68,10.16 101.6,10.16 101.6,11.75
  Bottom 0.152: v113.03,18.73 114.94,20.64 v116.52,20.64
N$43  (via drill 0.35)
  other vias: 100.33,15.24
N$44  (via drill 0.35)
  Top 0.152: 21.59,21.94 v21.59,19.37 | 21.59,21.94 21.59,22.23 | v62.55,12.7 62.55,12.38 60.64,10.48 59.69,10.48 U3.5 | U$6.2 14.29,31.43 13.97,31.43 13.34,30.8 13.34,30.48 13.62,30.48 13.76,30.34 17.49,30.34 20.1,27.72 20.1,26.89 21.59,25.4 21.59,21.94
  Bottom 0.152: v21.59,19.37 25.4,15.56 62.23,15.56 63.5,14.29 63.5,12.7 v62.55,12.7
N$45
  Top 0.152: 29.53,39.37 R2.1 29.53,39.37 | 29.53,39.37 30.8,38.1 31.11,38.1 U$2.2 | 29.53,39.37 R3.2
N$46  (via drill 0.35)
  Top 0.152: 83.5,25.4 83.5,24.77 U$25.7 83.19,24.77 79.06,24.77 DNC3.2 | U$4.5 118.43,16.19 118.43,18.1 121.28,20.95 121.28,23.5 119.38,25.4 119.06,25.4 118.43,26.04 U$3.5 118.43,26.35 118.43,28.26 121.28,31.11 121.28,33.34 119.38,35.24 | 119.38,35.24 118.43,36.2 U$5.5 | 83.5,25.4 85.09,25.4 88.27,28.57 88.27,28.89 88.58,29.21 v95.57,29.21 | 119.38,35.24 v117.16,35.24 | 83.5,25.4 U$25.6
  Bottom 0.152: v95.57,29.21 102.87,36.51 105.73,36.51 107,35.24 v117.16,35.24
N$47  (via drill 0.35)
  Top 0.152: 108.27,13.34 DNC2.2 108.27,13.34 | 108.27,13.34 109.22,12.38 109.22,12.06 113.67,7.62 114.3,7.62 114.62,7.94 114.62,14.61 115.89,15.88 U$4.1 | 83.5,28.57 83.5,27.94 U$25.2 | 115.89,27.94 115.89,26.35 U$3.1 | 115.89,27.94 116.84,28.89 118.43,28.89 120.97,31.43 120.97,32.7 119.06,34.61 116.84,34.61 115.89,35.56 115.89,36.2 U$5.1 | 83.5,28.57 87.31,28.57 88.58,29.84 v98.74,29.84 | 115.89,27.94 v115.57,28.26 | 83.5,28.57 U$25.1 | v112.71,17.78 108.27,13.34 | v110.49,28.26 v110.49,20
  Bottom 0.152: v98.74,29.84 100.33,28.26 v110.49,28.26 v115.57,28.26 | v110.49,20 v112.71,17.78
N$48  (via drill 0.35)
  Top 0.152: U$25.13 89.22,27.94 89.22,28.57 U$25.14 89.53,28.57 v97.47,28.57 | v116.52,17.46 116.52,16.19 U$4.2 | v115.25,18.41 115.25,24.77 114.62,25.4 | 114.62,25.4 114.3,25.72 v114.3,26.04 | v116.52,27.62 116.52,26.35 U$3.2 | v116.52,38.73 116.52,36.51 U$5.2 | v115.57,39.69 114.62,38.73 114.62,25.4
  Bottom 0.152: v116.52,17.46 115.57,18.41 v115.25,18.41 | v116.52,27.62 115.89,27.62 v114.3,26.04 100.01,26.04 v97.47,28.57 | v115.57,39.69 v116.52,38.73
N$49  (via drill 0.35)
  Top 0.152: 89.22,24.77 89.22,25.4 U$25.9 | v86.04,24.77 89.22,24.77 | v83.5,22.23 DNC4.2 81.92,20.32 81.92,17.46 83.5,15.88 97.16,15.88 v99.38,18.1 | 89.22,24.77 U$25.8 | 120.65,29.21 121.6,28.26 121.6,25.31 122.53,24.38 122.53,23.88 121.6,22.95 121.6,16.19 120.65,15.24 118.11,15.24 117.79,15.56 117.79,15.88 U$4.4 | 120.65,29.21 120.65,29.84 123.55,32.74 123.55,34.57 123.51,34.61 123.52,34.64 123.52,36.83 122.89,37.47 118.43,37.47 117.79,36.83 117.79,36.51 U$5.4 | v117.79,27.62 117.79,26.35 U$3.4 | 120.65,29.21 v119.06,27.62
  Bottom 0.152: v83.5,22.23 v86.04,24.77 | v119.06,27.62 118.11,27.62 | v99.38,18.1 100.65,16.83 104.46,16.83 111.44,23.81 117.16,23.81 118.11,24.77 118.11,27.62 | 118.11,27.62 v117.79,27.62
N$50
  Top 0.152: U$2.12 37.15,37.47 36.83,37.47 36.2,36.83 34.29,36.83 34.29,36.51 36.2,34.61 36.67,34.13 37.15,33.66 40.96,33.66 42.86,35.56 49.53,35.56 52.07,38.1 52.07,38.19 52.36,38.48 52.36,38.99 52.07,39.28 52.07,39.37 52.42,39.72 53.59,39.72 54.83,40.96 56.83,40.96 U1.13 57.15,40.96 57.47,40.96 58.74,42.23 C9.1
N$52  (via drill 0.35)
  Top 0.152: v44.77,39.37 44.45,39.05 43.18,39.05 U4.16 | U1.16 56.83,39.05 56.2,39.05 55.87,38.72 54.61,38.72 54.61,38.73 v54.29,39.05 | v75.25,40.01 74.3,39.05 73.66,39.05 U5.16 73.34,39.05 69.12,39.05 68.83,38.76 68.33,38.76 68.04,39.05 v65.09,39.05
  Bottom 0.152: v44.77,39.37 52.2,39.37 52.53,39.04 53.58,39.04 53.93,38.69 | U$1.34 114.3,46.99 114.3,40.96 100.65,40.96 99.38,39.69 75.56,39.69 v75.25,40.01 | v65.09,39.05 60.55,38.41 54.21,38.41 53.93,38.69 | 53.93,38.69 v54.29,39.05
N$53  (via drill 0.35)
  Top 0.152: v38.73,37.78 38.1,37.15 38.1,36.51 37.78,36.2 37.47,36.2 U$2.10 | v46.67,38.73 47.62,39.69 48.26,39.69 U4.6
  Bottom 0.152: v38.73,37.78 39.05,38.1 40.96,38.1 41.59,38.73 v46.67,38.73
N$54  (via drill 0.35)
  Top 0.152: 37.15,38.42 37.15,38.73 U$2.14 | 37.15,38.42 37.15,38.1 U$2.13 | v35.88,38.42 37.15,38.42 | v34.92,39.37 38.42,42.86 C10.2
  Bottom 0.152: v34.92,39.37 v35.88,38.42
N$55  (via drill 0.35)
  Top 0.152: v35.56,11.43 36.51,10.48 36.83,10.48 U2.16 | v34.61,13.34 34.61,20.32 35.56,21.27 35.56,22.86 | U6.16 41.59,22.54 40.96,22.54 40.64,22.86 35.56,22.86 | v62.23,9.53 63.18,10.48 64.77,10.48 U3.16 | 63.18,23.18 63.5,23.18 U7.16 63.54,23.43 62.95,23.43 62.81,23.56 62.24,24.13 62.23,24.13 62.23,29.21 61.28,30.16 60.96,30.16 56.52,34.61 53.88,34.61 53.59,34.9 53.09,34.9 52.8,34.61 43.18,34.61 39.69,31.11 39.69,25.4 38.98,24.69 35.98,24.69 35.85,24.55 35.85,23.15 35.56,22.86
  Bottom 0.152: v34.61,13.34 35.56,13.34 v35.56,11.43 36.51,10.48 61.28,10.48 v62.23,9.53
N$56  (via drill 0.35)
  Top 0.152: v9.84,33.97 8.57,33.97 U$6.11 | v47.94,47.31 93.03,47.31 v99.06,41.27
  Bottom 0.152: v9.84,33.97 25.08,49.21 46.04,49.21 v47.94,47.31 | v99.06,41.27 101.92,44.13 105.41,44.13 106.68,45.4 106.68,46.99 109.22,46.99 U$1.30
N$57
  Top 0.152: U$2.8 37.47,34.92 39.37,34.92 R4.1
N$58
  Top 0.152: 39.37,36.2 38.73,35.56 37.47,35.56 U$2.9 | DNC5.1 40.64,40.96 40.64,41.91 42.86,42.23 U4.11 43.18,42.23 43.91,42.23 44.2,42.52 44.7,42.52 45.06,42.16 45.06,41.97 45.57,39.95 45.71,39.81 45.71,39.42 45.71,39.41 | 39.37,36.2 41.91,36.2 42.23,35.88 44.77,35.88 45.45,36.56 45.47,36.54 45.97,36.54 46.33,36.9 46.33,37.4 45.97,37.75 45.84,37.75 45.71,38.15 45.71,39.4 45.71,39.41 | 39.37,36.2 R4.2 | 45.71,39.41 45.72,39.37
N$59  (via drill 0.35)
  Top 0.152: v18.41,13.34 18.1,13.02 18.1,7.3 14.92,4.13 14.61,4.13 U$23.1 | v15.56,15.24 14.92,15.24 14.61,15.56 U$22.1 | 14.61,23.18 17.46,20.32 17.46,18.1 v16.19,16.83 | v52.07,22.86 C20.1 | 14.61,23.18 v16.19,23.18 | 14.61,23.18 U$21.1
  Bottom 0.152: v18.41,13.34 16.51,15.24 16.19,15.24 | v15.56,15.24 16.19,15.24 | 16.19,15.24 v16.19,16.83 | v52.07,22.86 51.75,23.18 v16.19,23.18
N$60
  Top 0.152: C20.2 57.15,21.27 58.1,21.27 U7.8 58.42,21.27 58.74,21.27 60.01,20 63.5,20 U7.11
N$62
  Top 0.152: U2.17 37.15,11.11 37.78,11.11 39.69,9.21 C7.1 40.01,7.62 40.01,5.08 C6.2
N$63  (via drill 0.35)
  Top 0.152: v32.7,36.2 31.43,36.2 U$2.5 | v32.7,37.47 33.34,38.1 C11.1 33.66,41.91 34.29,42.55 34.29,47.31 35.88,48.9 93.34,48.9 v104.14,38.1 | v107.31,35.88 107.31,20.64 105.09,18.41 104.14,18.41 103.5,19.05 103.5,19.37 U$7.3 | 42.23,40.96 42.86,40.96 U4.13 41.11,40.99 40.64,40.53 v40.64,38.73
  Bottom 0.152: v32.7,36.2 v32.7,37.47 35.88,37.47 36.83,38.42 40.32,38.42 v40.64,38.73 | v107.31,35.88 105.09,38.1 v104.14,38.1
N$64  (via drill 0.35)
  Top 0.152: v117.16,37.78 117.16,36.51 U$5.3 | v107,38.1 107,44.13 U$1.25
  Bottom 0.152: v117.16,37.78 116.84,38.1 v107,38.1
N$65  (via drill 0.35)
  Top 0.152: v115.57,14.29 117.16,15.88 U$4.3 | v109.54,20 109.54,38.73 v110.17,39.37 | v109.22,40.32 109.22,42.86 106.68,45.4 106.68,46.99 U$1.26
  Bottom 0.152: v115.57,14.29 114.62,15.24 114.3,15.24 v109.54,20 | v109.22,40.32 v110.17,39.37
N$66  (via drill 0.35)
  Top 0.152: v12.06,35.24 8.57,35.24 U$6.9 | v46.67,47.31 47.31,46.67 v92.71,46.67
  Bottom 0.152: v12.06,35.24 22.54,45.72 45.09,45.72 v46.67,47.31 | v92.71,46.67 93.03,46.99 106.05,46.99 107.31,48.26 U$1.28
N$67
  Top 0.152: 59.37,8.57 U3.8 59.17,8.29 58.58,8.29 57.91,7.62 55.88,7.62 55.15,8.35 55.15,8.57 | C7.2 42.55,8.57 48.99,8.57 49.28,8.28 49.78,8.28 50.07,8.57 55.15,8.57 | U$25.5 83.19,26.04 79.69,26.04 76.52,22.86 70.8,22.86 61.91,13.97 61.91,12.38 61.28,11.75 59.69,11.75 U3.3 59.37,11.75 57.78,11.75 56.17,10.13 56.17,9.59 55.15,8.57
N$68  (via drill 0.35)
  Top 0.152: v21.59,36.2 13.97,36.2 12.38,34.61 8.57,34.61 U$6.10 | v48.58,46.04 93.34,46.04 v99.06,40.32 | v109.22,43.81 109.22,44.45 U$1.29
  Bottom 0.152: v21.59,36.2 28.26,42.86 45.4,42.86 v48.58,46.04 | v99.06,40.32 102.55,43.81 v109.22,43.81
N$69  (via drill 0.35)
  Top 0.152: v117.47,25.08 117.16,25.4 117.16,26.04 U$3.3 | v113.98,24.45 112.71,25.72 v112.71,41.91
  Bottom 0.152: v117.47,25.08 116.84,24.45 v113.98,24.45 | v112.71,41.91 109.54,45.09 108.9,45.09 108.27,45.72 U$1.27
N$70  (via drill 0.35)
  Top 0.152: 42.23,38.42 42.86,38.42 U4.17 43.14,38.15 43.73,38.15 43.78,38.1 v44.45,38.1 | v35.24,33.97 33.02,31.75 C12.1 | v77.15,36.83 78.11,37.78 78.74,37.78 U5.3
  Bottom 0.152: v35.24,33.97 37.78,33.97 41.59,37.78 44.88,37.78 | v77.15,36.83 76.83,37.15 71.44,37.15 69.85,35.56 68.9,35.56 66.36,38.1 58.12,38.1 55.88,35.87 52.38,35.87 51.36,36.29 51.18,36.47 50.67,36.47 49.57,36.93 48.43,37.41 48.06,37.78 47.79,37.78 44.88,37.78 | v44.45,38.1 44.77,37.78 44.88,37.78
N$72
  Top 0.152: U$2.6 31.43,35.56 31.43,34.92 U$2.7 31.11,34.92 31.11,31.75 C12.2
N$73  (via drill 0.35)
  Top 0.152: U$7.1 104.78,19.68 106.05,20.95 106.05,21.59 R11.2 100.65,27.3 v100.65,29.84 | v80.64,40.96 79.06,40.96 U5.8 | v84.14,40.32 90.17,40.32 v99.38,31.11
  Bottom 0.152: v80.64,40.96 81.28,40.32 v84.14,40.32 | v100.65,29.84 v99.38,31.11
N$74
  Top 0.152: R11.1 104.14,21.27 104.14,19.68 U$7.2 | R11.1 R10.2 | R11.1
N$75  (via drill 0.35)
  Top 0.152: 76.52,40.96 77.79,39.69 78.74,39.69 U5.6 | 76.52,40.96 75.25,42.23 73.66,42.23 U5.11 | v78.42,26.04 76.2,26.04 C17.1 | v80.64,28.26 77.15,31.75 76.83,31.75 76.52,32.07 76.52,40.96
  Bottom 0.152: v80.64,28.26 v78.42,26.04
N$76  (via drill 0.35)
  Top 0.152: v100.97,17.46 103.5,14.92 103.5,13.65 U$7.12 | v75.88,37.78 75.88,40.32 75.25,40.96 73.66,40.96 U5.13
  Bottom 0.152: v100.97,17.46 80.64,37.78 v75.88,37.78
N$77  (via drill 0.35)
  Top 0.152: 104.14,13.65 104.78,13.65 U$7.14 | v116.52,25.08 117.16,24.45 117.16,22.23 U$4.14 | v117.16,29.53 117.16,32.07 U$3.14 | v113.35,29.53 113.35,40.96 115.57,43.18 116.52,43.18 117.16,42.55 U$5.14 | v104.14,17.46 v104.14,14.92 104.14,13.65 | 104.14,13.65 U$7.13 | v70.48,14.29 DNC1.2
  Bottom 0.152: v113.35,29.53 v117.16,29.53 117.16,27.3 116.84,26.99 116.52,26.99 v116.52,25.08 111.76,25.08 v104.14,17.46 | v70.48,14.29 70.8,13.97 103.19,13.97 v104.14,14.92
N$79  (via drill 0.35)
  Top 0.152: 98.11,13.97 C16.1 98.11,13.97 | 98.11,13.97 98.74,14.61 101.6,14.61 102.23,13.97 102.23,13.65 U$7.10 | v75.88,34.61 75.88,35.24 73.98,37.15 73.66,37.15 U5.19 | 98.11,13.97 v98.11,14.92
  Bottom 0.152: v75.88,34.61 80.01,30.48 82.55,30.48 v98.11,14.92
N$80  (via drill 0.35)
  Top 0.152: C14.1 58.1,28.57 58.1,25.72 U7.1 58.42,25.72 59.37,25.72 v60.01,25.08 | v118.43,23.5 118.43,22.23 U$4.12 | v122.24,27.3 122.24,29.67 122.58,30.04 122.58,30.41 122.94,30.77 123.25,30.77 124.16,31.75 124.16,37.8 119.28,41.57 118.81,41.57 118.68,41.7 118.68,42.03 118.43,42.23 U$5.12 | v118.43,30.8 118.43,32.07 U$3.12
  Bottom 0.152: v118.43,30.8 119.06,30.16 121.6,30.16 122.24,29.53 v122.24,27.3 v118.43,23.5 111.76,23.5 102.55,14.29 97.79,14.29 94.93,17.14 67.94,17.14 v60.01,25.08
N$88  (via drill 0.35)
  Top 0.152: R8.2 C13.1 23.5,44.45 24.13,45.09 24.13,45.4 26.35,47.62 v33.02,47.62 | v118.75,24.77 117.79,23.81 117.79,22.23 U$4.13 | v118.43,29.84 117.79,30.48 117.79,32.07 U$3.13 | v121.28,29.53 121.92,30.16 121.92,30.48 122.22,30.48 122.81,31.07 123.12,31.07 123.85,31.87 123.85,34.9 123.83,34.92 123.83,37.47 123.19,38.1 118.86,41.26 118.47,41.26 118.03,41.7 118.03,41.86 117.79,42.04 117.79,42.23 U$5.13 | v35.88,47.31 45.4,47.31 46.99,45.72 48.04,45.72 48.33,45.43 48.83,45.43 49.12,45.72 87.31,45.72 v100.65,32.38
  Bottom 0.152: v118.75,24.77 120.33,26.35 120.33,29.84 | 120.33,29.84 v118.43,29.84 118.11,30.16 102.87,30.16 v100.65,32.38 | v121.28,29.53 120.97,29.84 120.33,29.84 | v33.02,47.62 33.34,47.31 v35.88,47.31
N$95  (via drill 0.35)
  Top 0.152: v9.84,20 8.57,20 U$22.9 | v96.84,6.99 113.67,6.99 115.25,5.4 | v119.38,20.64 119.7,20.64 120.33,21.27 120.33,21.91 U$4.9 | v122.24,19.37 122.24,15.88 115.25,8.89 115.25,5.4 | 115.25,5.4 U$1.14
  Bottom 0.152: v9.84,20 15.88,20 29.84,6.03 95.89,6.03 v96.84,6.99 | v119.38,20.64 120.65,19.37 v122.24,19.37
N$97  (via drill 0.35)
  Top 0.152: v40.32,19.68 35.56,14.92 35.56,12.38 34.29,11.11 31.75,11.11 U2.4 | v45.09,21.91 46.99,21.91 U6.4 | v50.8,18.1 52.39,19.68 | 52.39,19.68 54.61,21.91 54.61,23.81 54.93,24.13 56.2,24.13 56.52,23.81 58.1,23.81 U7.4 | v58.1,11.11 59.37,11.11 U3.4 | v55.88,13.34 55.88,16.19 52.39,19.68
  Bottom 0.152: v40.32,19.68 41.27,20.64 43.5,20.64 43.81,20.95 43.81,21.91 v45.09,21.91 46.99,21.91 v50.8,18.1 | v55.88,13.34 v58.1,11.11
N$98  (via drill 0.35)
  Top 0.152: v59.05,39.69 59.05,37.47 59.69,36.83 60.33,36.83 61.91,38.42 62.23,38.42 U1.4 | v77.15,38.42 78.74,38.42 U5.4 | U4.4 48.78,38.64 49.37,38.64 49.51,38.77 49.51,38.83 51.17,39.38 51.24,39.38 51.3,39.4 51.63,39.73 51.72,39.93 51.72,40.45 51.95,40.67 52.29,40.32 v53.34,40.32
  Bottom 0.152: v53.34,40.32 53.66,40.01 58.74,40.01 v59.05,39.69 67.63,39.69 68.58,40.64 68.99,40.64 69.6,40.03 70.46,40.03 71.12,39.37 76.2,39.37 76.83,38.73 | 76.83,38.73 v77.15,38.42 | U$1.35 114.62,42.23 114.62,39.69 111.44,39.69 110.49,38.73 76.83,38.73
N$101  (via drill 0.35)
  Top 0.152: 44.45,31.75 58.74,31.75 60.48,30 60.48,29.59 60.35,29.46 60.35,28.96 60.64,28.67 60.64,24.13 62.87,21.91 63.5,21.91 U7.14 63.82,21.91 v65.09,21.91 | 44.45,31.75 40.96,31.75 40.01,30.8 40.01,24.77 40.96,23.81 41.59,23.81 U6.14 | v45.72,37.15 45.4,38.1 45.4,39.69 44.77,40.32 43.18,40.32 U4.14 | 44.45,31.75 v44.45,33.97 | 57.78,40.32 57.15,40.32 U1.14 | 57.78,40.32 58.42,39.69 v58.42,37.47 | 57.78,40.32 v60.96,40.32 | U5.14 73.34,40.32 71.44,40.32 69.85,41.91 68.58,41.91 67.83,41.57 67.56,41.3 67.25,41.3 v66.36,40.32 | v61.91,6.67 59.05,3.81 39.69,3.81 39.37,4.13 39.37,6.03 38.73,6.67 38.73,8.26 37.78,9.21 37.15,9.21 U2.14 | U3.14 64.77,9.21 64.45,9.21 v62.87,7.62 63.82,6.67 65.72,6.67 75.88,16.83 v75.88,17.78
  Bottom 0.152: v44.45,33.97 v45.72,37.15 46.04,37.15 46.37,37.48 47.92,37.48 48.25,37.15 48.26,37.15 50.61,36.17 51.05,36.17 51.36,35.85 52.07,35.56 56.52,35.56 v58.42,37.47 | v60.96,40.32 v66.36,40.32 | v61.91,6.67 v62.87,7.62 63.82,8.57 109.22,8.57 109.22,3.81 U$1.9 | v65.09,21.91 69.22,17.78 v75.88,17.78
V+  (via drill 0.35)
  Top 0.152: v115.25,34.29 115.89,33.66 115.89,32.38 U$3.16 | U$5.16 115.89,42.23 113.98,40.32 v113.98,34.61 113.98,26.67 113.67,26.35 113.67,25.72 114.62,24.77 v114.62,19.37 106.68,19.37 105.41,18.1 103.82,18.1 103.5,18.41 | v115.89,19.68 115.89,21.91 U$4.16 | 103.5,18.41 102.87,19.05 U$7.4 | U$1.1 96.2,6.67 96.2,13.97 100.17,17.94 | 100.17,17.94 100.65,18.41 103.5,18.41 | U1.19 56.83,37.15 56.83,36.51 U1.20 | U1.20 57.15,36.51 62.23,36.51 U1.1 62.55,36.51 68.58,30.48 | 63.82,25.72 63.82,25.08 U7.19 | 73.66,35.56 73.66,36.51 U5.20 | 73.66,35.56 73.66,34.29 81.28,26.67 U$25.4 v85.41,26.67 | 73.66,35.56 68.58,30.48 | 68.58,30.48 63.82,25.72 | 63.82,25.72 U7.20 | U3.20 65.09,13.02 65.09,12.38 U3.19 64.77,12.38 63.18,12.38 60.64,9.84 59.69,9.84 U3.6 59.37,9.84 v57.47,9.84 | 37.15,13.65 37.15,15.56 41.27,19.68 | 37.15,13.65 37.15,13.02 U2.20 | 41.27,19.68 41.59,20 U6.20 | v55.56,9.84 40.96,9.84 37.15,13.65 | U$22.16 8.26,15.56 5.71,13.02 5.71,5.08 6.67,4.13 8.26,4.13 U$23.16 8.57,4.13 v11.11,4.13 | U$6.16 8.57,30.8 12.7,30.8 13.97,32.07 14.29,32.07 U$6.3 14.61,32.07 v16.83,32.07 | 33.34,36.83 U$2.4 30.8,36.83 v27.62,33.66 27.62,20.32 26.99,19.68 | 33.34,36.83 35.88,39.37 37.78,39.37 38.73,38.42 40.01,38.42 41.27,37.15 42.86,37.15 | 42.86,37.15 42.86,36.51 U4.20 | 42.86,37.15 U4.19 | 26.99,19.68 v19.68,12.38 | 41.27,19.68 40.64,20.32 40.01,20.32 35.24,15.56 35.24,13.02 34.92,12.7 33.97,12.7 26.99,19.68 | 33.34,36.83 36.83,33.34 41.27,33.34 42.86,34.92 52.69,34.92 52.96,35.2 53.72,35.2 54.01,34.91 56.5,34.91 56.87,35.28 U1.20 | 100.17,17.94 99.98,18.13 99.98,18.35 99.63,18.7 99.13,18.7 98.2,17.78 91.44,17.78 90.17,19.05 v90.17,21.91
  Bottom 0.152: v115.25,34.29 114.94,34.61 v113.98,34.61 | v115.89,19.68 115.57,19.37 v114.62,19.37 | v55.56,9.84 v57.47,9.84 | v16.83,32.07 18.1,33.34 27.3,33.34 v27.62,33.66 | v11.11,4.13 18.73,11.75 19.05,11.75 v19.68,12.38 | v85.41,26.67 v90.17,21.91

### Text on the board
tNames: SDMAY18-TEAM#31 / PCB DESIGN REV1